# EAGLE design tweeq-extMod_DualSidePB (EAGLE 7.2.0)
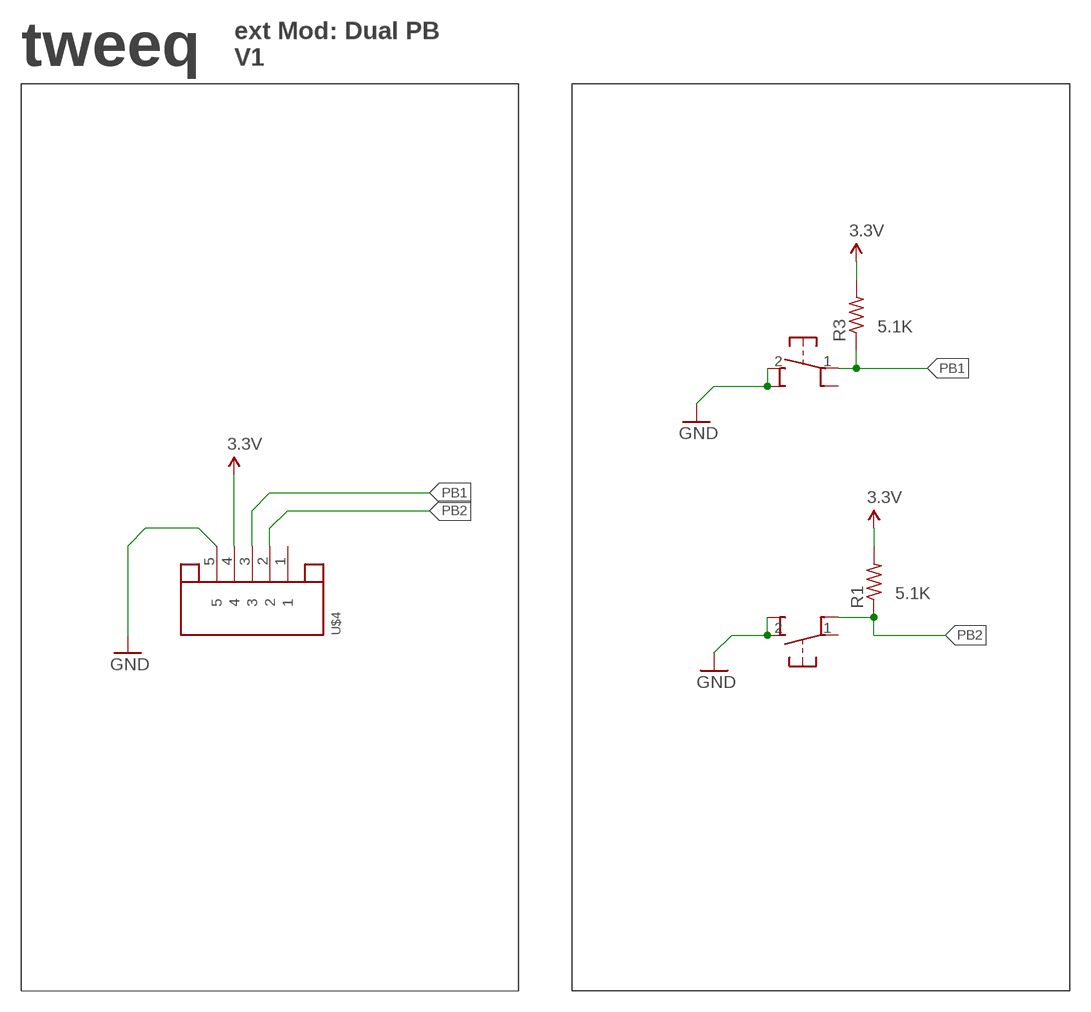
[diagram p0: schematic, sheet 1]

## Parts
R1  5.1K  R-US_R0402  [R0402]
R3  5.1K  R-US_R0402  [R0402]
U$2  PB_MICRO_SMTRIGHTANGLE  [PB_SMT_90D6.2X4.6]
U$4  JST-5PINSH  [SH1.0-5PIN]
U$5  PB_MICRO_SMTRIGHTANGLE  [PB_SMT_90D6.2X4.6]

## Nets
3.3V: R1.2 R3.2 U$4.4
GND: U$2.2 U$2.2A U$4.5 U$5.2 U$5.2A
PB1: R3.1 U$4.3 U$5.1
PB2: R1.1 U$2.1A U$4.2
Unconnected: U$2.1 U$4.1 U$5.1A

## Notes on the sheet
- tweeq
- ext Mod: Dual PB
  V1

## Library data of the parts
R1 R3 = AISCube:R-US_: RESISTOR, American symbol
U$2 U$5 = AISCube:PB_MICRO_SMT
U$4 = AISCube:JST-5PIN: JST 5 Pin

## Board
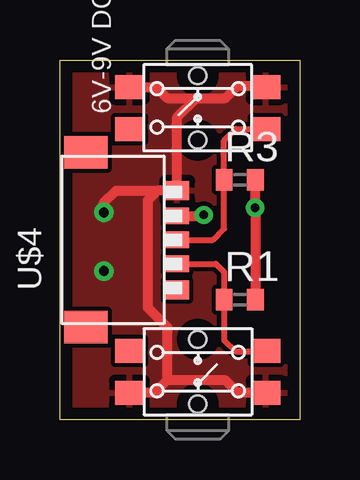
[diagram p1: board, top side]
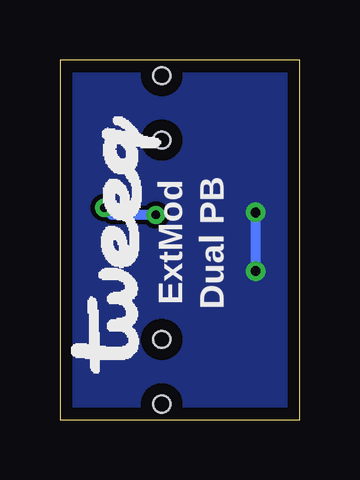
[diagram p2: board, bottom side, seen from below]

Size 10 x 15 mm. Coordinates in mm from the lower left corner, seen from the top.
Outline: 0,15 10,15 10,0 0,0 0,15
Copper layers (1*16): Top 0.0356mm / dielectric 1.5011mm / Bottom 0.0356mm
Design rules "AISCube": minimum track width 7mil, minimum drill 14mil, track to track 7mil, track to pad 7mil, pad to pad 7mil, via to via 7mil, smd to smd 0mil, copper to edge 20mil, drill to drill 8mil, minimum pad ring 10mil, minimum via ring 8mil, stop-mask expansion 4mil, vias tented up to drill 32mil, thermal gap 10mil

### Footprints (pad centres in the part's own frame; a part is rotated, then mirrored left to right if it is on the bottom)
R0402 = smd 0.7 x 0.9: 1 -0.65,0; 2 0.65,0
PB_SMT_90D6.2X4.6 = smd 1.2 x 1: 1 -2.85,0.875; 1A 2.85,0.875; 2 -2.85,-0.875; 2A 2.85,-0.875 | hole 0.7: 0,-1.35; 0,1.35
SH1.0-5PIN = smd 0.8 x 1: 1 -2.09,-0.55; 5 2.05,-0.55 | smd 0.7 x 1: 2 -1,-0.55; 3 0,-0.55; 4 1,-0.55 | smd 1.35 x 1.8: P$1 -3.65,3.25; P$2 3.65,3.25

### Placement (x,y rotation side)
R1  7.5,5 0 top
R3  7.5,10 0 top
U$2  5.75,2 0 top
U$3  [TWEEQ-LOGO-L]  5.79,1.93 90 bottom
U$4  4.34,7.5 90 top
U$5  5.75,13 180 top

### Tracks (layer width: path | path; a pad name or v marks a point on that pad's centre or on a via)
3.3V  (via drill 0.36)
  Top 0.406: R1.2 v8.15,8.84 R3.2 | U$4.4 5.96,8.5 v5.99,8.53
  Bottom 0.406: v5.99,8.53 7.84,8.53 v8.15,8.84
GND  (via drill 0.41)
  Top 0.406: U$2.2A 7.41,1.12 6.91,1.63 4.47,1.63 | 4.47,1.63 3.96,1.12 U$2.2 | U$5.2A 4.01,13.88 4.47,13.41 5.69,13.41 | 5.69,13.41 6.91,13.41 7.42,13.92 8.56,13.92 U$5.2 | 5.69,13.41 4.89,12.61 U$4.5 4.06,9.55 | 4.06,9.55 3.66,9.14 3.66,4.67 4.47,3.86 4.47,1.63 | v1.83,8.64 1.83,9.04 2.34,9.55 4.06,9.55
  Bottom 0.406: v1.83,6.2 v1.83,8.64
  pour Top: 9.8,14.79 9.8,0.18 0.15,0.18 0.15,14.79
  pour Bottom: 9.8,0.18 9.8,14.79 0.15,14.79 0.15,0.18
PB1
  Top 0.254: U$4.3 6.38,7.5 6.85,7.97 R3.1 6.85,11.62 7.35,12.12 U$5.1
PB2
  Top 0.254: U$4.2 6.5,6.5 6.85,6.16 R1.1 6.85,3.31 7.32,2.85 8.57,2.85 U$2.1A

### Text on the board
bPlace: Dual PB | ExtMod
tNames: 6V-9V DC | ON
bNames: Breadboard | V-Reg | Module